# EAGLE design l (EAGLE 8.2.1)
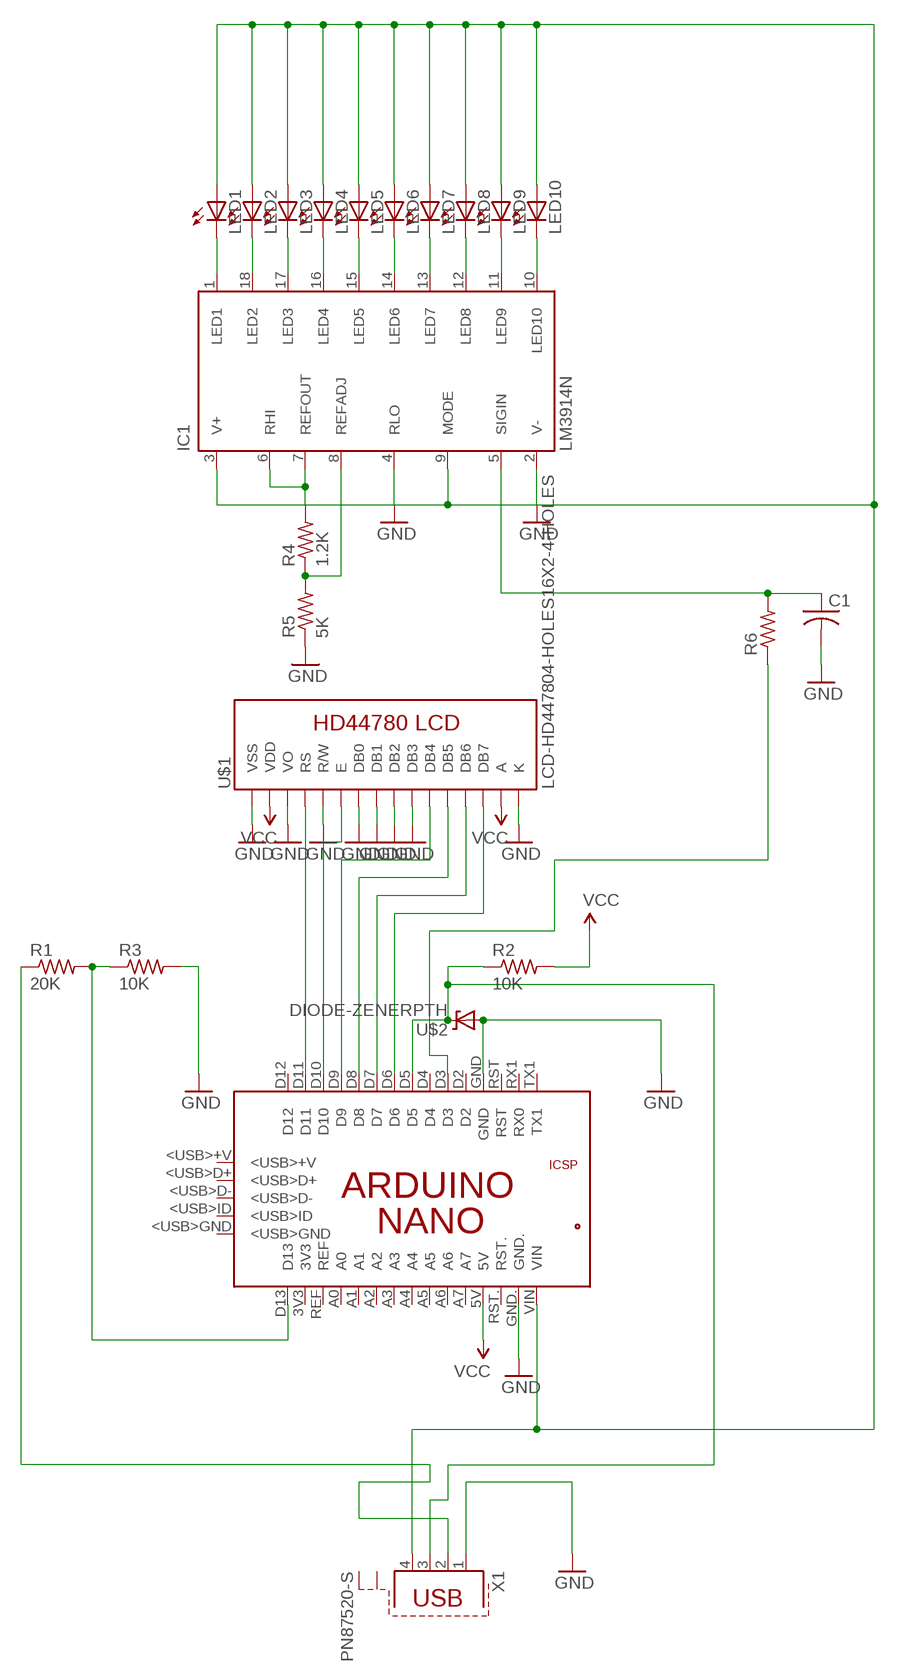
[diagram p0: schematic, sheet 1]

## Parts
C1  C-US025-040X050  [C025-040X050]
IC1  LM3914N  [DIL18]
LED1  LED5MM  [LED5MM]
LED2  LED5MM  [LED5MM]
LED3  LED5MM  [LED5MM]
LED4  LED5MM  [LED5MM]
LED5  LED5MM  [LED5MM]
LED6  LED5MM  [LED5MM]
LED7  LED5MM  [LED5MM]
LED8  LED5MM  [LED5MM]
LED9  LED5MM  [LED5MM]
LED10  LED5MM  [LED5MM]
PCB1  ARDUINO_NANO  [ARDUINO_NANO]
R1  20K  R-US_0204/7  [0204/7]
R2  10K  R-US_0204/7  [0204/7]
R3  10K  R-US_0204/7  [0204/7]
R4  1.2K  R-US_0204/7  [0204/7]
R5  5K  R-US_0204/7  [0204/7]
R6  R-US_0204/7  [0204/7]
U$1  LCD-HD447804-HOLES16X2-4-HOLES  [LCD-16X2-4HOLES]
U$2  DIODE-ZENERPTH  [DIODE-ZENER]
X1  PN87520-S  [PN87520-S]

## Nets
GND: C1.2 IC1.2(V-) IC1.4(RLO) PCB1.GND PCB1.GND. R3.2 R5.1 U$1.1(VSS) U$1.3(VO) U$1.5(R/W) U$1.7(DB0) U$1.8(DB1) U$1.9(DB2) U$1.10(DB3) U$1.16(K) U$2.P$2(A) X1.1
N$1: PCB1.D6 U$1.14(DB7)
N$2: PCB1.D7 U$1.13(DB6)
N$3: PCB1.D8 U$1.12(DB5)
N$4: PCB1.D9 U$1.11(DB4)
N$5: PCB1.D10 U$1.6(E)
N$6: PCB1.D11 U$1.4(RS)
N$7: IC1.3(V+) IC1.9(MODE) LED1.A LED2.A LED3.A LED4.A LED5.A LED6.A LED7.A LED8.A LED9.A LED10.A PCB1.VIN X1.4
N$8: PCB1.D5 R2.1 U$2.P$1(C) X1.3
N$9: PCB1.D13 R1.2 R3.1
N$10: IC1.1(LED1) LED1.K(C)
N$11: R1.1 X1.2
N$12: IC1.18(LED2) LED2.K(C)
N$13: IC1.17(LED3) LED3.K(C)
N$14: IC1.16(LED4) LED4.K(C)
N$15: IC1.15(LED5) LED5.K(C)
N$16: IC1.14(LED6) LED6.K(C)
N$17: IC1.13(LED7) LED7.K(C)
N$18: IC1.12(LED8) LED8.K(C)
N$19: IC1.11(LED9) LED9.K(C)
N$20: IC1.10(LED10) LED10.K(C)
N$21: IC1.6(RHI) IC1.7(REFOUT) R4.2
N$22: IC1.8(REFADJ) R4.1 R5.2
N$23: C1.1 IC1.5(SIGIN) R6.2
N$24: PCB1.D3 R6.1
VCC: PCB1.5V R2.2 U$1.2(VDD) U$1.15(A)
Unconnected: PCB1.3V3 PCB1.5V. PCB1.<USB>+V PCB1.<USB>D+ PCB1.<USB>D- PCB1.<USB>GND PCB1.<USB>ID PCB1.A0 PCB1.A1 PCB1.A2 PCB1.A3 PCB1.A4 PCB1.A5 PCB1.A6 PCB1.A7 PCB1.D2 PCB1.D4 PCB1.D12 PCB1.GND_ PCB1.MISO PCB1.MOSI PCB1.REF PCB1.RESET.. PCB1.RST PCB1.RST. PCB1.RX1(RX0) PCB1.SCK PCB1.TX1 X1.S1 X1.S2

## Library data of the parts
C1 = adafruit:C-US: CAPACITOR, American symbol
IC1 = national-semiconductor:LM391: Dot/Bar Display Driver Source: Data sheet LM3915 <http://www.national.com/ds/LM/LM3915.pdf> Data sheet LM3914 <http://www.national.com/ds/LM/LM3914.pdf>
LED1-LED10 = led:LED: LED OSRAM: - CHIPLED LG R971, LG N971, LY N971, LG Q971, LY Q971, LO R971, LY R971 LH N974, LH R974 LS Q976, LO Q976, LY Q976 LO Q996 - Hyper CHIPLED LW Q18S LB Q993, LB Q99A, LB R99A - SideLED LS A670, LO A670, LY A670, LG A670, LP A670 LB A673, LV A673, LT A673, LW A673 LH A674 LY A675 LS A676, LA A676, LO A676, LY A676, LW A676 LS A679, LY A679, LG A679 - Hyper Micro SIDELED® LS Y876, LA Y876, LO Y876, LY Y876 LT Y87S - SmartLED LW L88C, LW L88S LB L89C, LB L89S, LG L890 LS L89K, LO L89K, LY L89K LS L896, LA L896, LO L896, LY L896 - TOPLED LS T670, LO T670, LY T670, LG T670, LP T670 LSG T670, LSP T670, LSY T670, LOP T670, LYG T670 LG T671, LOG T671, LSG T671 LB T673, LV T673, LT T673, LW T673 LH T674 LS T676, LA T676, LO T676, LY T676, LB T676, LH T676, LSB T676, LW T676 LB T67C, LV T67C, LT T67C, LS T67K, LO T67K, LY T67K, LW E67C LS E67B, LA E67B, LO E67B, LY E67B, LB E67C, LV E67C, LT E67C LW T67C LS T679, LY T679, LG T679 LS T770, LO T770, LY T770, LG T770, LP T770 LB T773, LV T773, LT T773, LW T773 LH T774 LS E675, LA E675, LY E675, LS T675 LS T776, LA T776, LO T776, LY T776, LB T776 LHGB T686 LT T68C, LB T68C - Hyper Mini TOPLED® LB M676 - Mini TOPLED Santana® LG M470 LS M47K, LO M47K, LY M47K Source: http://www.osram.convergy.de LUXEON: - LUMILED® LXK2-PW12-R00, LXK2-PW12-S00, LXK2-PW14-U00, LXK2-PW14-V00 LXK2-PM12-R00, LXK2-PM12-S00, LXK2-PM14-U00 LXK2-PE12-Q00, LXK2-PE12-R00, LXK2-PE12-S00, LXK2-PE14-T00, LXK2-PE14-U00 LXK2-PB12-K00, LXK2-PB12-L00, LXK2-PB12-M00, LXK2-PB14-N00, LXK2-PB14-P00, LXK2-PB14-Q00 LXK2-PR12-L00, LXK2-PR12-M00, LXK2-PR14-Q00, LXK2-PR14-R00 LXK2-PD12-Q00, LXK2-PD12-R00, LXK2-PD12-S00 LXK2-PH12-R00, LXK2-PH12-S00 LXK2-PL12-P00, LXK2-PL12-Q00, LXK2-PL12-R00 Source: www.luxeon.com KINGBRIGHT: KA-3528ASYC Source: www.kingbright.com
PCB1 = E14_Arduino_revC:ARDUINO_NANO: Device for representing an Arduino Nano board with a footprint in an EAGLE design. Created by Dave Young for Element14. More EAGLE documentation at: http://www.element14.com/community/community/knode/cadsoft_eagle
R1-R6 = adafruit:R-US_: RESISTOR, American symbol
U$1 = HD44780LCD:LCD-HD44780
U$2 = SparkFun:DIODE-ZENER: Zener Diode Production Part - 8199 3.4V Zener Voltage
X1 = con-berg:PN87520-S; OC_FARNELL: unknown; OC_NEWARK: unknown

## Board
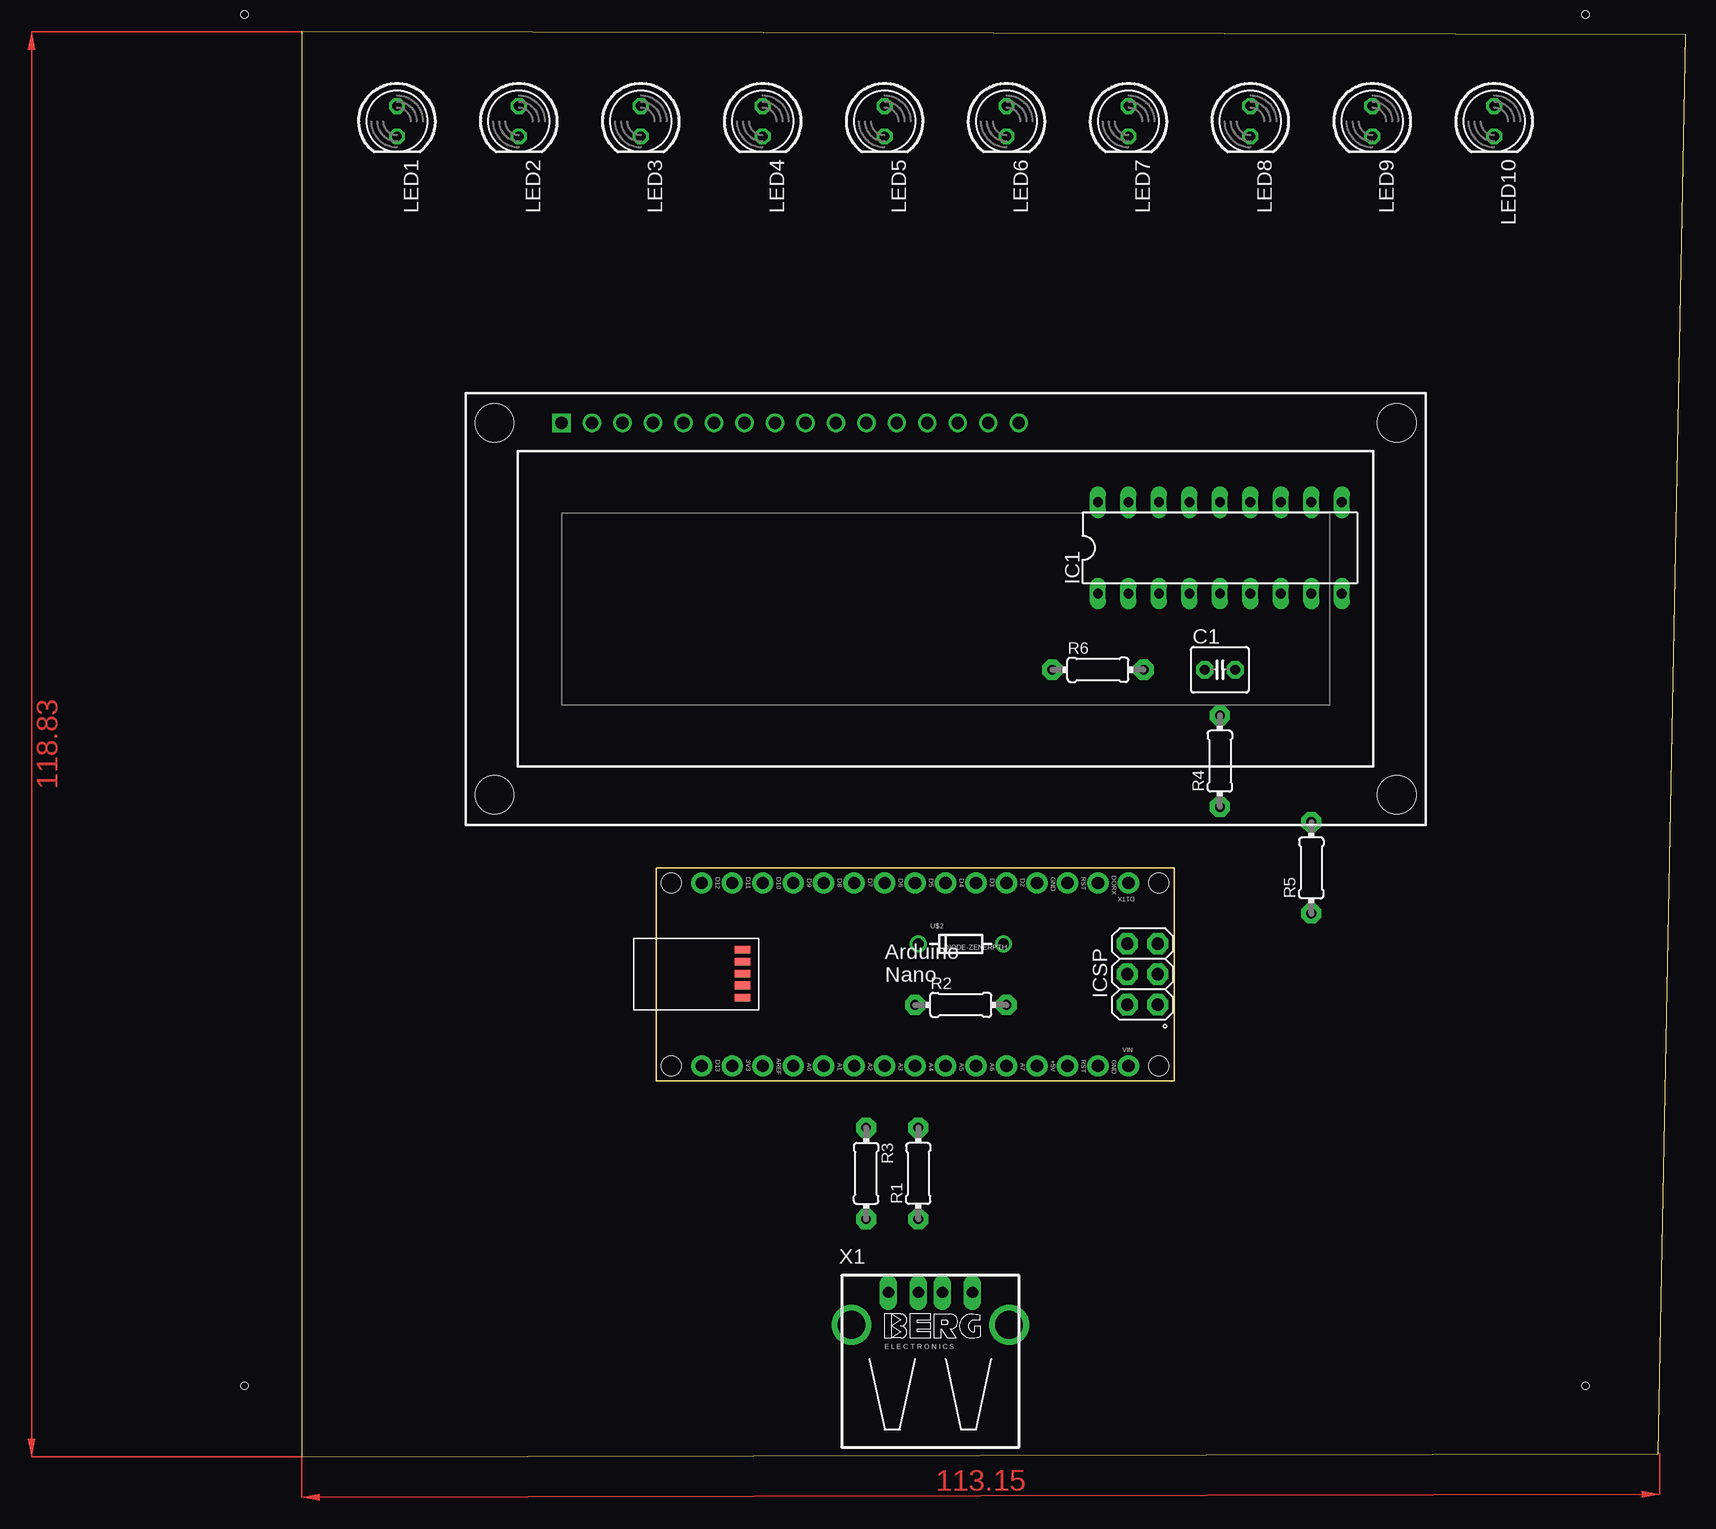
[diagram p1: board, top side]
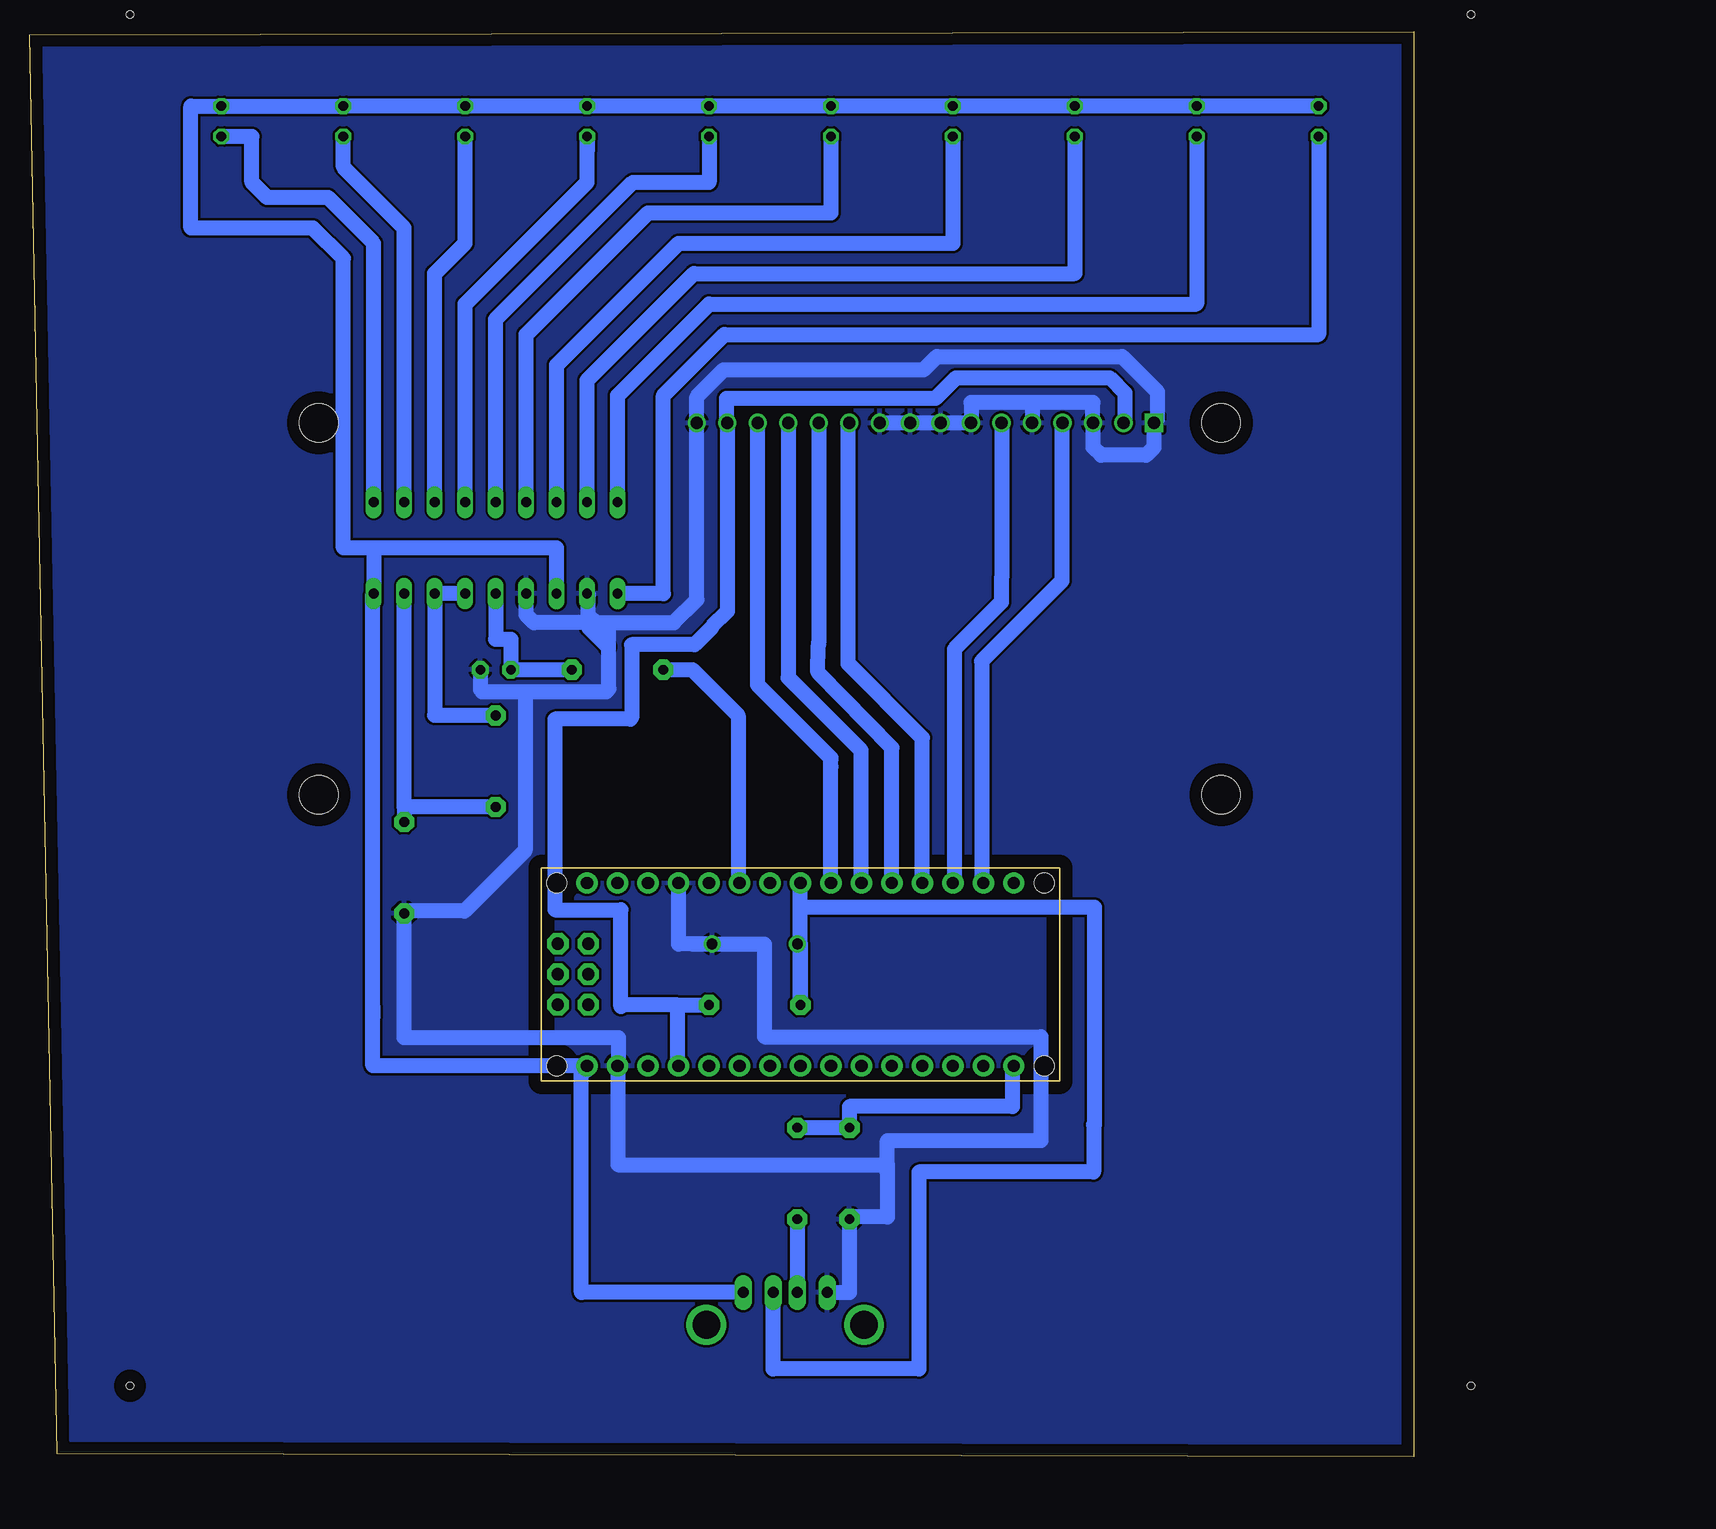
[diagram p2: board, bottom side, seen from below]

Size 115.32 x 118.83 mm. Coordinates in mm from the lower left corner, seen from the top.
Outline: 0,0 113.04,0.29 115.32,118.54 0,118.83 0,0
Copper layers (1*16): Top 0.035mm / dielectric 1.5mm / Bottom 0.035mm
Design rules "default": minimum track width 10mil, minimum drill 24mil, track to track 8mil, track to pad 8mil, pad to pad 8mil, via to via 8mil, smd to smd 8mil, copper to edge 40mil, drill to drill 8mil, minimum pad ring 10mil, minimum via ring 8mil, stop-mask expansion 4mil, vias tented up to drill 0mil, thermal gap 10mil
Holes 0.6 mm at -4.76,120.24 107,120.24 -4.76,5.94 107,5.94

### Footprints (pad centres in the part's own frame; a part is rotated, then mirrored left to right if it is on the bottom)
C025-040X050 = drill 0.813 pad 1.422 octagon: 1 -1.27,0; 2 1.27,0
DIL18 = drill 0.813 long: 1 -10.16,-3.81; 2 -7.62,-3.81; 3 -5.08,-3.81; 4 -2.54,-3.81; 5 0,-3.81; 6 2.54,-3.81; 7 5.08,-3.81; 8 7.62,-3.81; 9 10.16,-3.81; 10 10.16,3.81; 11 7.62,3.81; 12 5.08,3.81; 13 2.54,3.81; 14 0,3.81; 15 -2.54,3.81; 16 -5.08,3.81; 17 -7.62,3.81; 18 -10.16,3.81
LED5MM = drill 0.813 octagon: A -1.27,0; K 1.27,0
ARDUINO_NANO = drill 1.016 pad 1.778: 3V3 6.35,1.27; 5V 31.75,1.27; A0 11.43,1.27; A1 13.97,1.27; A2 16.51,1.27; A3 19.05,1.27; A4 21.59,1.27; A5 24.13,1.27; A6 26.67,1.27; A7 29.21,1.27; D2 29.21,16.51; D3 26.67,16.51; D4 24.13,16.51; D5 21.59,16.51; D6 19.05,16.51; D7 16.51,16.51; D8 13.97,16.51; D9 11.43,16.51; D10 8.89,16.51; D11 6.35,16.51; D12 3.81,16.51; D13 3.81,1.27; GND 31.75,16.51; GND. 36.83,1.27; REF 8.89,1.27; RST 34.29,16.51; RST. 34.29,1.27; RX1 36.83,16.51; TX1 39.37,16.51; VIN 39.37,1.27 | drill 1.016 pad 1.778 octagon: 5V. 39.268,6.375; GND_ 39.268,11.455; MISO 41.808,6.375; MOSI 39.268,8.915; RESET.. 41.808,11.455; SCK 41.808,8.915 | smd 1.27 x 0.635: <USB>+V 7.214,10.947; <USB>D+ 7.214,9.957; <USB>D- 7.214,8.941; <USB>GND 7.214,6.96; <USB>ID 7.214,7.976 | hole 1.651: 1.27,1.27; 1.27,16.51; 41.91,16.51; 41.91,1.27
0204/7 = drill 0.813 pad 1.676 octagon: 1 -3.81,0; 2 3.81,0
LCD-16X2-4HOLES = drill 1.016 square: 1 -32,15.5 | drill 1.016: 2 -29.46,15.5; 3 -26.92,15.5; 4 -24.38,15.5; 5 -21.84,15.5; 6 -19.3,15.5; 7 -16.76,15.5; 8 -14.22,15.5; 9 -11.68,15.5; 10 -9.14,15.5; 11 -6.6,15.5; 12 -4.06,15.5; 13 -1.52,15.5; 14 1.02,15.5; 15 3.56,15.5; 16 6.1,15.5 | hole 3.2: -37.6,15.5; -37.6,-15.5; 37.6,-15.5; 37.6,15.5
DIODE-ZENER = drill 0.9: P$1 -3.556,0; P$2 3.556,0
PN87520-S = drill 0.95 long: 1 -3.5,2.71; 2 -1,2.71; 3 1,2.71; 4 3.5,2.71 | drill 2.3 pad 2.9: S1 -6.57,0; S2 6.57,0

### Placement (x,y rotation side)
C1  76.52,65.63 0 top
IC1  76.52,75.79 0 top
LED1  7.94,111.35 270 top
LED2  18.1,111.35 270 top
LED3  28.26,111.35 270 top
LED4  38.42,111.35 270 top
LED5  48.58,111.35 270 top
LED6  58.74,111.35 270 top
LED7  68.9,111.35 270 top
LED8  79.06,111.35 270 top
LED9  89.22,111.35 270 top
LED10  99.38,111.35 270 top
PCB1  29.53,31.34 0 top
R1  51.38,23.64 90 top
R2  54.93,37.69 0 top
R3  47.03,23.64 270 top
R4  76.52,58.01 90 top
R5  84.14,49.12 90 top
R6  66.36,65.63 0 top
U$1  53.66,70.71 0 top
U$2  54.93,42.77 0 top
X1  52.39,11.02 0 top

### Tracks (layer width: path | path; a pad name or v marks a point on that pad's centre or on a via)
GND
  Bottom 1.27: 67.08,69.55 61.66,69.55 59.76,71.45 U$1.16 59.76,88.39 57.51,90.63 40.85,90.63 39.75,91.73 24.3,91.73 21.38,88.81 21.38,86.49 U$1.1 21.66,84.16 22.31,83.51 26.07,83.51 26.72,84.16 26.72,86.19 U$1.3 26.75,87.91 31.82,87.91 | 68.14,69.55 68.79,70.2 68.79,71.87 IC1.2 | 68.14,69.55 73.34,69.55 73.98,70.19 IC1.4 | 31.82,87.91 U$1.5 | 31.82,87.91 36.9,87.91 U$1.7 U$1.8 U$1.9 U$1.10 | 67.08,69.55 67.08,64.03 67.3,63.81 74.06,63.81 | C1.2 77.79,63.96 77.64,63.81 74.06,63.81 | 74.06,63.81 74.06,50.56 79.11,45.5 83.94,45.5 R5.1 84.14,34.96 66.28,34.96 66.28,32.61 PCB1.GND. 66.33,32.61 66.33,25.66 66.34,25.66 66.34,24.36 43.87,24.36 43.87,23.59 | U$2.P$2 60.08,42.77 | 60.08,42.77 61.28,42.77 PCB1.GND 61.51,47.85 61.51,47.76 | X1.1 47.03,13.73 R3.2 47.03,20.01 43.87,20.01 43.87,23.59 | 60.08,42.77 54.12,42.77 54.12,40.83 54.12,35.04 31.08,35.04 31.08,26.37 43.87,26.37 43.87,23.59 | 68.14,69.55 67.08,69.55
  pour Bottom: -33.97,153.26 -33.97,-23.27 179.39,-23.27 179.39,153.26
N$1
  Bottom 1.27: PCB1.D6 48.58,57.54 | 48.58,57.54 48.58,58.16 | U$1.14 54.68,64.37 48.58,58.27 48.58,57.54
N$2
  Bottom 1.27: U$1.13 52.14,64.98 46.09,58.93 46.09,47.9 PCB1.D7
N$3
  Bottom 1.27: PCB1.D8 43.5,59.12 49.67,65.4 49.62,67.67 49.6,67.87 U$1.12
N$4
  Bottom 1.27: U$1.11 47.15,86.12 47.15,66.13 40.96,59.94 PCB1.D9
N$5
  Bottom 1.27: U$1.6 34.36,73.28 34.38,73.26 34.38,71.26 38.29,67.35 38.29,47.97 PCB1.D10
N$6
  Bottom 1.27: U$1.4 29.34,86.21 29.34,73.03 36.03,66.34 36.03,48 PCB1.D11
N$7
  Bottom 1.27: LED1.A LED2.A LED3.A LED4.A LED5.A LED6.A LED7.A LED8.A LED9.A LED10.A 101.92,112.62 101.92,102.46 91.76,102.46 89.22,99.92 89.22,75.79 86.68,75.79 | IC1.3 71.44,75.79 86.68,75.79 | 86.68,75.79 IC1.9 86.74,71.98 86.74,37.5 | 86.74,37.5 86.74,36.73 | 86.74,37.5 86.74,32.61 PCB1.VIN 68.9,32.23 69.37,32.23 69.37,13.73 X1.4
N$8
  Bottom 1.27: 51.12,42.77 51.12,45.85 | 51.12,45.85 PCB1.D5 | 51.12,42.77 R2.1 51.12,45.85 | U$2.P$1 51.12,42.77 | 51.12,45.85 26.63,45.85 26.63,27.72 26.69,27.72 26.69,23.77 41.26,23.77 41.26,7.35 53.39,7.35 X1.3
N$9
  Bottom 1.27: PCB1.D13 33.46,32.61 33.46,29.21 47.03,29.21 R3.1 R1.2
N$10
  Bottom 1.27: LED1.K 7.94,93.57 57.47,93.57 62.55,88.49 62.55,71.98 IC1.1
N$11
  Bottom 1.27: R1.1 X1.2
N$12
  Bottom 1.27: LED2.K 18.1,96.11 58.74,96.11 66.36,88.49 IC1.18
N$13
  Bottom 1.27: LED3.K 28.26,98.65 60.01,98.65 68.9,89.76 IC1.17
N$14
  Bottom 1.27: LED4.K 38.42,101.19 61.28,101.19 71.44,91.03 IC1.16
N$15
  Bottom 1.27: LED5.K 48.58,103.73 63.82,103.73 73.98,93.57 IC1.15
N$16
  Bottom 1.27: LED6.K 58.74,106.27 65.09,106.27 76.52,94.84 IC1.14
N$17
  Bottom 1.27: 68.9,108.81 LED7.K 68.9,106.27 79.06,96.11 IC1.13
N$18
  Bottom 1.27: IC1.12 81.6,98.65 79.06,101.19 LED8.K
N$19
  Bottom 1.27: IC1.11 84.14,102.46 89.22,107.54 LED9.K
N$20
  Bottom 1.27: IC1.10 86.68,101.19 90.49,105 95.57,105 96.84,106.27 96.84,110.08 LED10.K
N$21
  Bottom 1.27: R4.2 81.6,61.82 IC1.7 IC1.6
N$22
  Bottom 1.27: R4.1 84.14,54.2 | 84.14,54.2 R5.2 | 84.14,54.2 IC1.8
N$23
  Bottom 1.27: R6.2 C1.1 75.25,68.17 76.52,68.17 IC1.5
N$24
  Bottom 1.27: R6.1 60.13,65.63 56.32,61.81 56.32,47.97 PCB1.D3
N$29
  Bottom 1.27: 67.18,67.48 67.18,67.58 68.79,69.18
VCC
  Bottom 0.406: 57.47,85.95 arc-90 U$1.15
  Bottom 1.27: U$1.2 24.09,86.32 24.09,88.71 25.35,89.97 38.15,89.97 39.86,88.26 57.28,88.26 57.28,86.21 U$1.15 57.22,70.49 58.49,69.22 58.49,69.16 59.94,67.71 65.19,67.71 65.19,61.61 65.29,61.51 71.58,61.51 71.58,45.62 66.07,45.62 66.07,37.55 66.07,37.69 61.36,37.69 | 61.36,37.69 R2.2 | PCB1.5V 61.36,32.61 61.36,37.69
(copper drawn outside any net)
  shapes: Top area x2